# Altium schematic sheet PAGE4_RELAYS.SchDoc
size A; DrawnBy: Sean Donohue; Revision: A; SheetNumber: 4; SheetTotal: 4; Title2: RELAYS
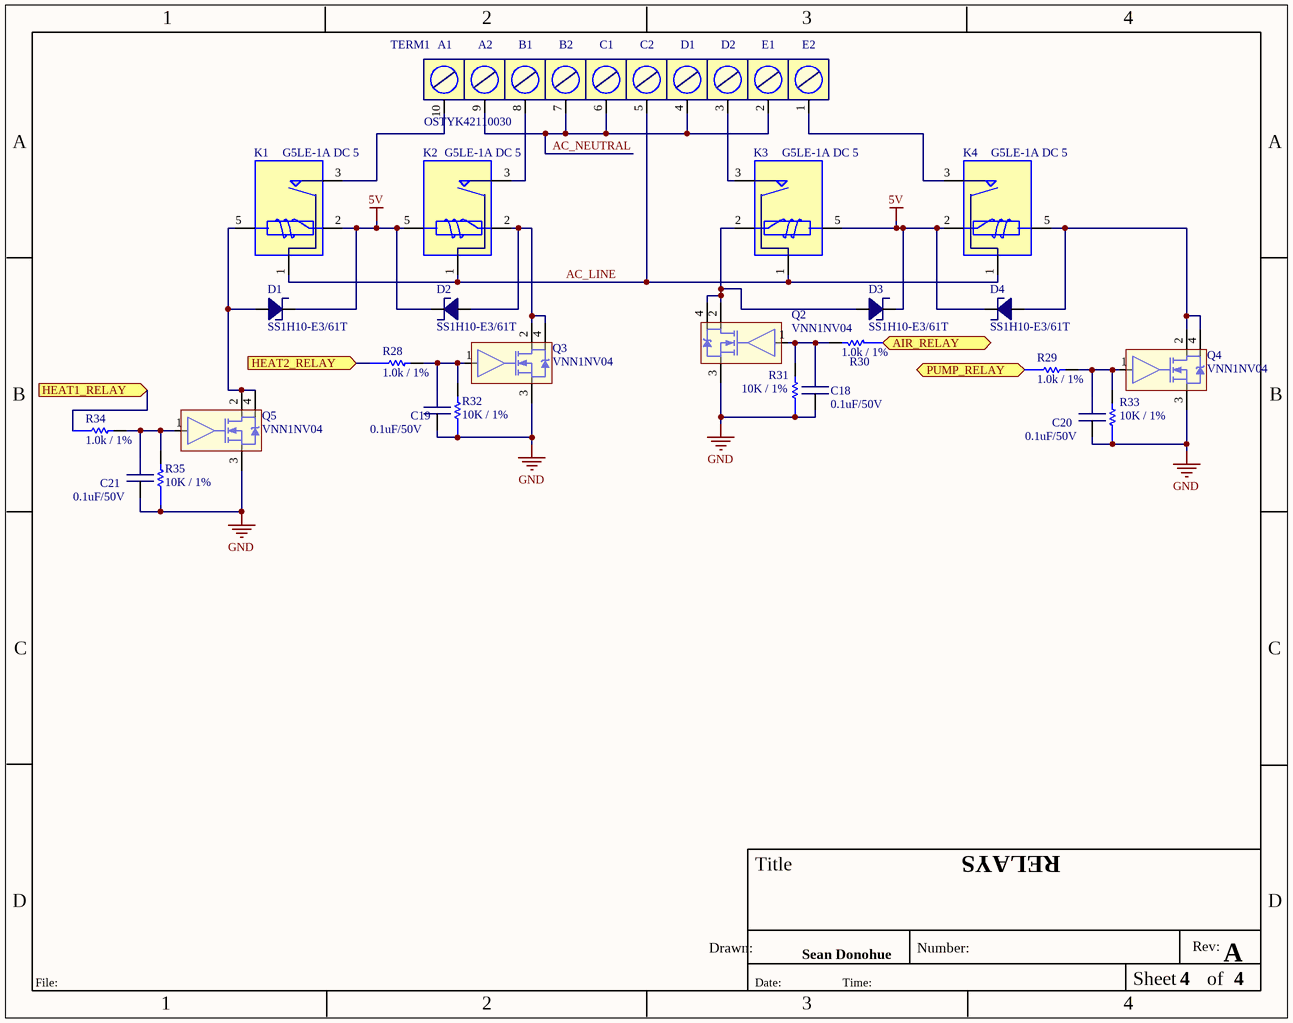
[diagram p0: PAGE4_RELAYS.SchDoc]

## Parts
C18  value 0.1uF/50V  [0603]  (hidden comment: cap)
C19  value 0.1uF/50V  [0603]  (hidden comment: cap)
C20  value 0.1uF/50V  [0603]  (hidden comment: cap)
C21  value 0.1uF/50V  [0603]  (hidden comment: cap)
D1  value SS1H10-E3/61T  [SMAZ]  (hidden comment: ds)
D2  value SS1H10-E3/61T  [SMAZ]  (hidden comment: ds)
D3  value SS1H10-E3/61T  [SMAZ]  (hidden comment: ds)
D4  value SS1H10-E3/61T  [SMAZ]  (hidden comment: ds)
K1  value G5LE-1A DC 5  [G5LE-SPST]  (hidden comment: G5LE-SPST)
K2  value G5LE-1A DC 5  [G5LE-SPST]  (hidden comment: G5LE-SPST)
K3  value G5LE-1A DC 5  [G5LE-SPST]  (hidden comment: G5LE-SPST)
K4  value G5LE-1A DC 5  [G5LE-SPST]  (hidden comment: G5LE-SPST)
Q2  value VNN1NV04  [SOT-223-4]  (hidden comment: NMOS-SOT-223-4)
Q3  value VNN1NV04  [SOT-223-4]  (hidden comment: NMOS-SOT-223-4)
Q4  value VNN1NV04  [SOT-223-4]  (hidden comment: NMOS-SOT-223-4)
Q5  value VNN1NV04  [SOT-223-4]  (hidden comment: NMOS-SOT-223-4)
R28  value 1.0k / 1%  [0603]  (hidden comment: Res)
R29  value 1.0k / 1%  [0603]  (hidden comment: Res)
R30  value 1.0k / 1%  [0603]  (hidden comment: Res)
R31  value 10K / 1%  [0603]  (hidden comment: Res)
R32  value 10K / 1%  [0603]  (hidden comment: Res)
R33  value 10K / 1%  [0603]  (hidden comment: Res)
R34  value 1.0k / 1%  [0603]  (hidden comment: Res)
R35  value 10K / 1%  [0603]  (hidden comment: Res)
TERM1  value OSTYK42110030  [BARRIER-STRP-10]  (hidden comment: BARR-STRP-10)

## Ports
AIR_RELAY (in), HEAT1_RELAY (in), HEAT2_RELAY (in), PUMP_RELAY (in)

## Nets
5V: D1.1(C) D2.1(C) D3.1(C) D4.1(C) K1.2 K2.5 K3.5 K4.2
GND: C18.2 C19.2 C20.2 C21.2 Q2.3(S) Q3.3(S) Q4.3(S) Q5.3(S) R31.1 R32.1 R33.1 R35.1
AC_LINE: K1.1 K2.1 K3.1 K4.1 TERM1.5
AC_NEUTRAL: TERM1.2 TERM1.4 TERM1.6 TERM1.7 TERM1.9
AIR_RELAY: R30.1 ; port AIR_RELAY
HEAT1_RELAY: R34.1 ; port HEAT1_RELAY
HEAT2_RELAY: R28.1 ; port HEAT2_RELAY
PUMP_RELAY: R29.1 ; port PUMP_RELAY
NetC18_1: C18.1 Q2.1(G) R30.2 R31.2
NetC19_1: C19.1 Q3.1(G) R28.2 R32.2
NetC20_1: C20.1 Q4.1(G) R29.2 R33.2
NetC21_1: C21.1 Q5.1(G) R34.2 R35.2
NetD1_2: D1.2(A) K1.5 Q5.2(D) Q5.4(D)
NetD2_2: D2.2(A) K2.2 Q3.2(D) Q3.4(D)
NetD3_2: D3.2(A) K3.2 Q2.2(D) Q2.4(D)
NetD4_2: D4.2(A) K4.5 Q4.2(D) Q4.4(D)
NetK1_3: K1.3 TERM1.10
NetK2_3: K2.3 TERM1.8
NetK3_3: K3.3 TERM1.3
NetK4_3: K4.3 TERM1.1

## Notes on the sheet
- (near TERM1) A1
- (near TERM1) A2
- (near TERM1) B1
- (near TERM1) B2
- (near TERM1) C1
- (near TERM1) C2
- (near TERM1) D1
- (near TERM1) D2
- (near TERM1) E1
- (near TERM1) E2
- 1
- 2
- 3
- 4
- A
- B
- C
- D
- Title
- Drawn:
- Number:
- Rev:
- File:
- Date:
- Time:
- Sheet
- of

## Library data of the parts
C18-C21 = ECM1045XQ: CAP CER 0.1UF 50V 10% X7R 0603; Mfg: Murata; MfgPN: GRM188R71H104KA93D; Vendor: Digikey; VendorPN: 490-1519-1-ND; Alt Mfg: TDK; Alt PN: C1608X7R1H104K; Unit Cost: 0.1; Temp: -55°C ~ 125°C; COST/10: 0.041; COST/50: 0.0222; COST/100: 0.0187; COST/500: 0.0131; EetrexPN: ECM1045XQ
D1-D4 = ED93: DIODE SCHOTTKY 100V 1A DO214AC; EetrexPN: ED93; Mfg: Vishay; Vendor: Digikey; VendorPN: SS1H10-E3/61TGICT-ND; Unit Cost: 0.371; TEMP: 175°C; MfgPN: SS1H10-E3/61T
K1-K4 = ELME53: RELAY GEN PURPOSE SPST 16A 5V; EetrexPN: ELME53; Mfg: Omron; MfgPN: G5LE-1A-E DC5; Vendor: Digikey; VendorPN: Z2619-ND; Unit Cost: 2.3; TEMP: -40°C ~ 85°C
Q2-Q5 = EXS0413NT: MOSFET N-CH 40V 1.7A SOT223; Mfg: ST Micro; MfgPN: VNN1NV0413TR; Vendor: Digikey; VendorPN: 497-11713-1-ND; Unit Cost: 1.19; Ref: E133; Temp: '-40°C ~ 150°C; COST/10: 1.05; COST/50: 0.9476; COST/100: 0.8291; COST/500: 0.64484; EetrexPN: EXS0413NT
R28-R30 R34 = ERE1001FP: RES 1.00K OHM 1/10W 1% 0603 SMD; Mfg: Vishay; MfgPN: CRCW06031K00FKEA; Vendor: Digikey; VendorPN: 541-1.00KHCT-ND; Unit Cost: 0.081; Temp: -55°C ~ 155°C; COST/50: 0.0436; EetrexPN: ERE1001FP; COST/10: 0.081; COST/100: 0.0436; COST/500: 0.0436
R31-R33 R35 = ER275: RES 10K OHM 1% 1/8W 0603 SMD; Mfg: Vishay; MfgPN: MCT06030C1002FP500; Vendor: Digikey; VendorPN: MCT0603-10.0K-CFCT-ND; EetrexPN: ER275; Unit Cost: 0.17; Temp: -55°C ~ 155°C
TERM1 = EKP113: CONN BARRIER STRP 10CIRC 0.325"; EetrexPN: EKP113; Mfg: On Shore Technology, Inc.; Vendor: Digikey; VendorPN: ED2952-ND; Unit Cost: 2.25; MfgPN: OSTYK42110030